# EasyEDA schematic SCH_Attiny85 DevBoard_2023-10-31.json
TITLE: Attiny85 Dev Board; REV: 1.0; Date: 2023-10-09; Sheet: 1/1; Drawn By: samarpan; Company: samarpan
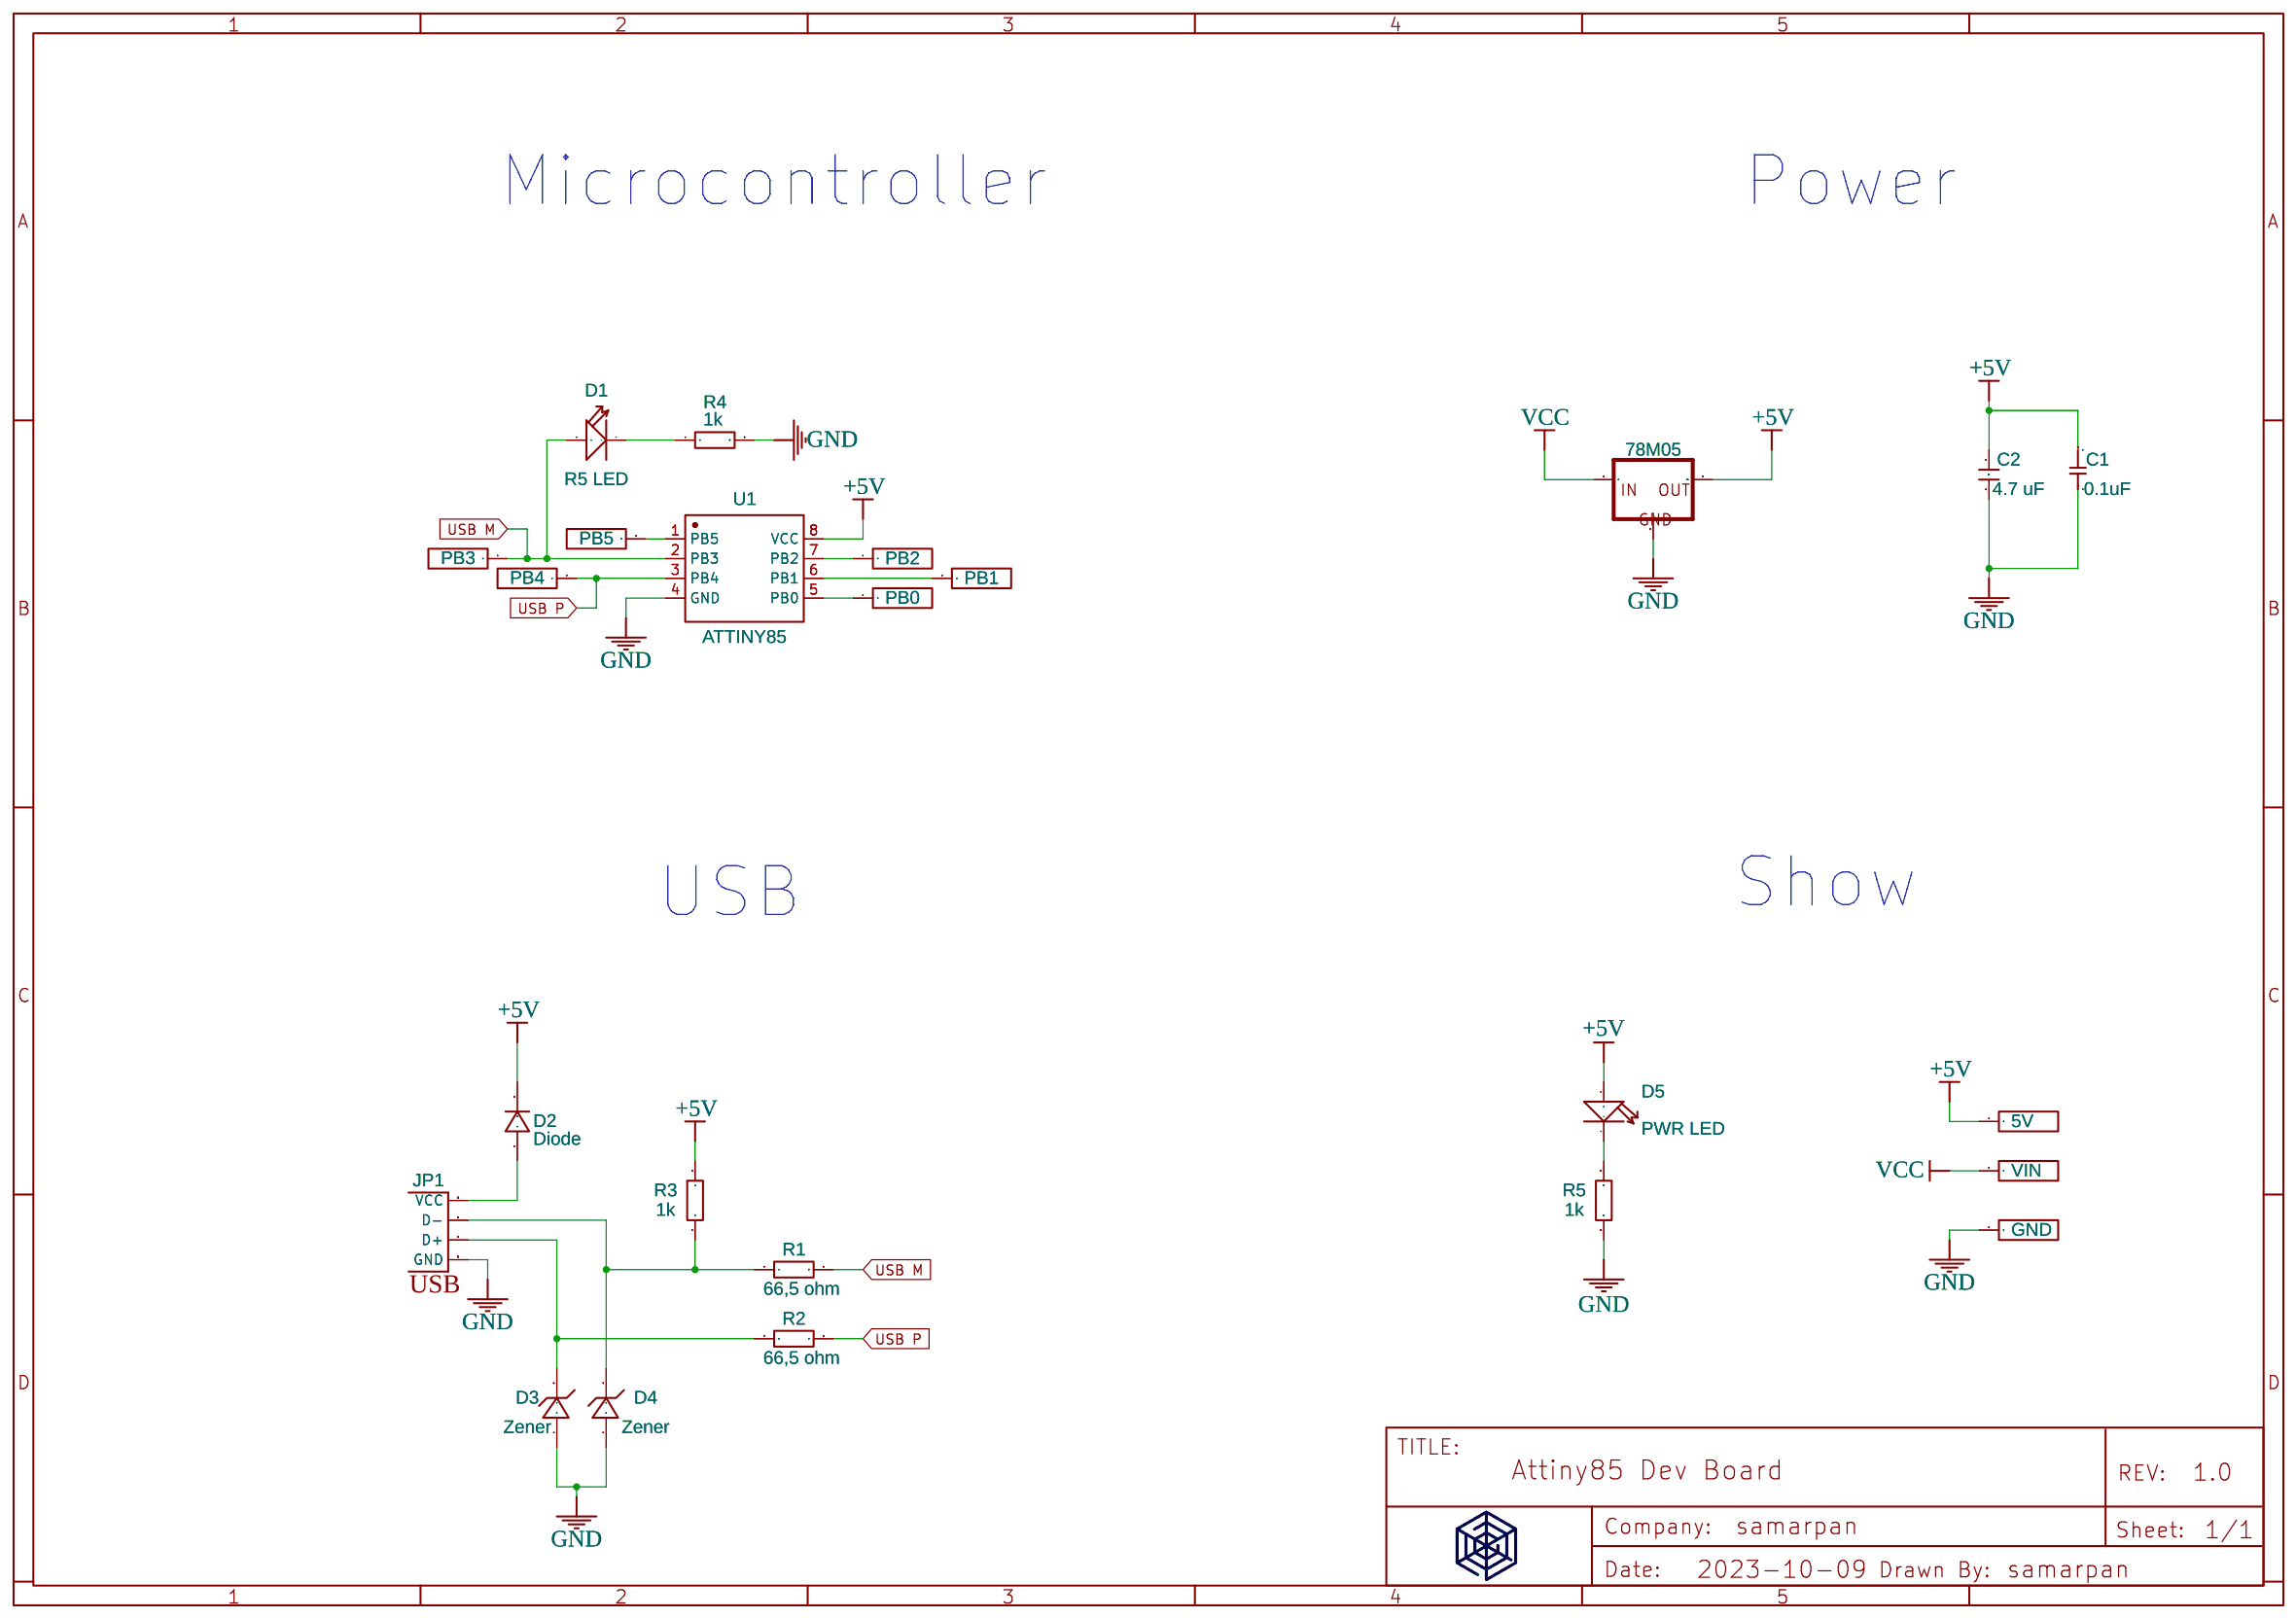
[diagram p0: schematic sheet]

## Parts
C1  0.1uF  [0402]
C2  4.7 uF  [0603 PAD CAPS AND RES INDUC]
D1  R5 LED  [LED_0402]
D2  Diode  [1206_Y01]
D3  Zener  [SOD-523_Y01]
D4  Zener  [SOD-523_Y01]
D5  PWR LED  [LED_0402]
H1  PB2  [MY_PIN]
H2  PB1  [MY_PIN]
H3  PB0  [MY_PIN]
H4  PB5  [MY_PIN]
H5  PB3  [MY_PIN]
H6  PB4  [MY_PIN]
H7  5V  [MY_PIN]
H8  VIN  [MY_PIN]
H9  GND  [MY_PIN]
JP1  USB  [USB-A-PCB]
R1  66,5 ohm  [R0402]
R2  66,5 ohm  [R0402]
R3  1k  [R0402]
R4  1k  [R0402]
R5  1k  [R0402]
U1  ATTINY85  [SOIC-8_L5.3-W5.3-P1.27-LS8.0-BL]
U2  78M05  [DPACK]

## Library data of the parts
C1 = CAPNP_0402: Contributor: olafl
C2 = 0603 Capacitor: Contributor: polishdude20
D1 D5 = LED Green 0402: SMD LED Yellow-Diffused-Pure White; Manufacturer Part: 16-219A/T2D-AR2T1QY/3T
D2 = Diode-1206-Y01: Contributor: Yusef
D3 D4 = Zener-SOD-523-Y01: Contributor: Yusef
H1-H9 = MY_PIN: Contributor: Lavberg1
JP1 = USB_pad: Contributor: Nathanial Swearingen (Drac)
R1-R5 = 0402WGJ0392TCE_C25938: Supplier: LCSC; Manufacturer: UniOhm; Manufacturer Part: 0402WGJ0392TCE; Supplier Part: C25938
U1 = ATTINY85V-10SU: Supplier: LCSC; Supplier Part: C152192; Manufacturer: Microchip Tech; Contributor: LCSC; SMT Type: Extend; JLCPCB SMD: Yes; LCSC Assembly: Yes
U2 = 78M05: Contributor: karthikj1985

## Nets
+5V: C1.P$1(1) C2.1 D2.2(K) D5.+ H7.1 R3.2 U1.8(VCC) U2.3(OUT)
GND: C1.P$2(2) C2.2 D3.1(A) D4.1(A) H9.1 JP1.GND R4.2 R5.1 U1.4(GND) U2.2(GND)
VCC: H8.1 U2.1(IN)
USB M: D1.+ H5.1 R1.2 U1.2(PB3)
USB P: H6.1 R2.2 U1.3(PB4)
Net-(D1--): D1.- R4.1
Net-(D2-1): D2.1(A) JP1.VCC
Net-(D3-2): D3.2(K) JP1.D+ R2.1
Net-(D4-2): D4.2(K) JP1.D- R1.1 R3.1
Net-(D5--): D5.- R5.2
Net-(H1-1): H1.1 U1.7(PB2)
Net-(H2-1): H2.1 U1.6(PB1)
Net-(H3-1): H3.1 U1.5(PB0)
Net-(H4-1): H4.1 U1.1(PB5)

## Notes on the sheet
- Microcontroller
- Power
- USB
- Show
